# Altium project lora_gateway.PrjPcb
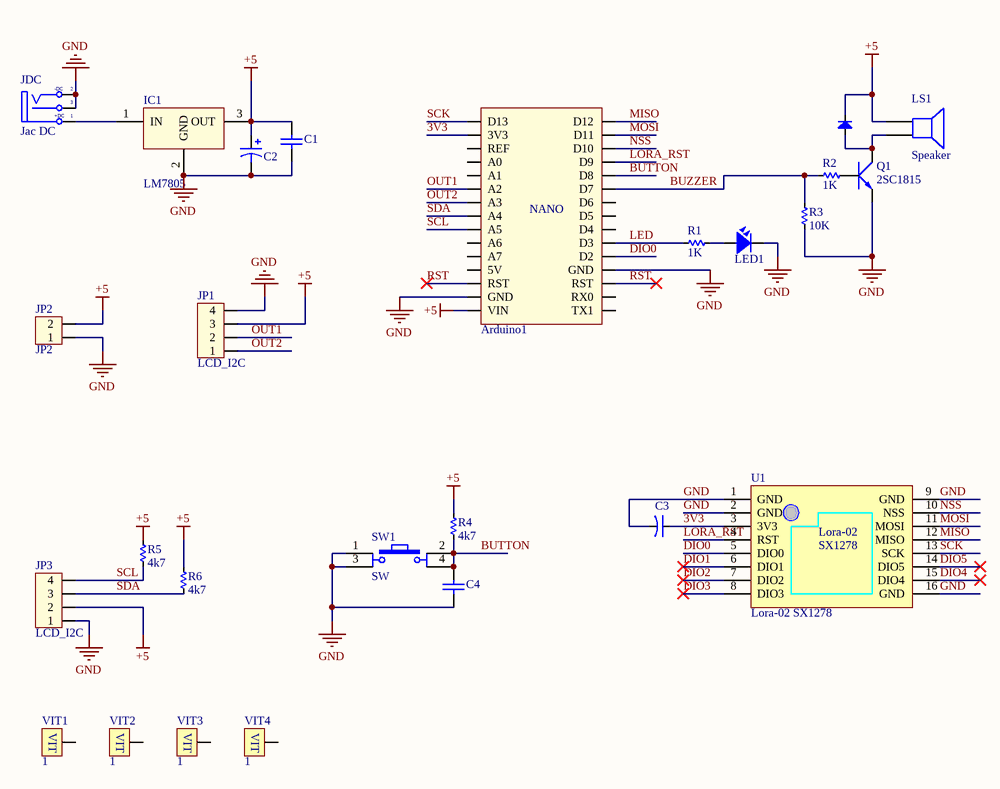
[diagram p0: Sheet1.SchDoc]
1 sheet, 26 parts. Net scope: global (net labels, ports and power ports of the same name join across sheets).
Board file: PCB1.PcbDoc

## Sheet Sheet1.SchDoc
size A; SheetNumber: 1; SheetTotal: 1

### Parts
Arduino1  Arduino Nano  [Arduino Nano]  (value not drawn)
C1  Capacitor Ceramic  [C0805]  (value not drawn)
C2  Cap Pol 8mm  [C10mm]  (value not drawn)
C3  CN-ALU-DIP  [CA-ALU-5W]  (value not drawn)
C4  Capacitor Ceramic  [C0805]  (value not drawn)
DIO1  Diode SMD  [DIO-SMD-106]  (value not drawn)
IC1  LM7805  [QTO-220]
JDC  Jac DC  [DC0]
JP1  LCD_I2C  [CON4]
JP2  JP2  [CON2]
JP3  LCD_I2C  [CON4]
LED1  LED  [LED-3MM-YELLOW]  (value not drawn)
LS1  Speaker  [SPEAKER]
Q1  2SC1815  [TO92-123]
R1  1K  [RES-SMD-1206]
R2  1K  [RES-SMD-1206]
R3  10K  [RES-SMD-1206]
R4  4k7  [RES-SMD-1206]
R5  4k7  [RES-SMD-1206]
R6  4k7  [RES-SMD-1206]
SW1  SW  [SW4]
U1  Lora-02 SX1278  [Lora02-sx1278]
VIT1  1  [VIT]
VIT2  1  [VIT]
VIT3  1  [VIT]
VIT4  1  [VIT]

### Nets
+5: Arduino1.VIN C1.2 C2.1 DIO1.2(K) IC1.3(OUT) JP1.3 JP2.2 JP3.2 LS1.1 R4.1 R5.1 R6.2
GND: Arduino1.GND C1.1 C2.2 C3.2 C4.1 IC1.2(GND) JDC.2(TN) JDC.3(S) JP1.4 JP2.1 JP3.1 LED1.2 Q1.1(E) R3.1 SW1.1 SW1.3 U1.1(GND) U1.2(GND) U1.9(GND) U1.16(GND)
3V3: Arduino1.3V3 C3.1 U1.3(3V3)
BUTTON: Arduino1.D8 C4.2 R4.2 SW1.2 SW1.4
BUZZER: Arduino1.D7 R2.1 R3.2
DIO0: Arduino1.D2 U1.5(DIO0)
DIO1: U1.6(DIO1)
DIO2: U1.7(DIO2)
DIO3: U1.8(DIO3)
DIO4: U1.15(DIO4)
DIO5: U1.14(DIO5)
LED: Arduino1.D3 R1.1
LORA_RST: Arduino1.D9 U1.4(RST)
MISO: Arduino1.D12 U1.12(MISO)
MOSI: Arduino1.D11 U1.11(MOSI)
NSS: Arduino1.D10 U1.10(NSS)
OUT1: Arduino1.A2 JP1.2
OUT2: Arduino1.A3 JP1.1
RST: Arduino1.RST
SCK: Arduino1.D13 U1.13(SCK)
SCL: Arduino1.A5 JP3.4 R5.2
SDA: Arduino1.A4 JP3.3 R6.1
NetDIO1_1: DIO1.1(A) LS1.2 Q1.2(C)
NetIC1_1: IC1.1(IN) JDC.1(T)
NetLED1_1: LED1.1 R1.2
NetQ1_3: Q1.3(B) R2.2

Not connected (* = marked no-connect by the designer): Arduino1 5V A0 A1 A6 A7 D4 D5 D6 REF RX0 TX1; VIT1 VIT1(1); VIT2 VIT1(1); VIT3 VIT1(1); VIT4 VIT1(1)

### Notes on the sheet
- (in symbol Arduino Nano) NANO
- (in symbol DCIN) -DC; +DC
- (in symbol Lora-02 SX1278) Lora-02; SX1278

### Library data of the parts
Arduino1 = Arduino Nano: Value: Cau 1A
C1 C4 = CapSMD: Capacitor; Value: 33p; Published: 8-Jun-2000; LatestRevisionDate: 17-Jul-2002; LatestRevisionNote: Re-released for DXP Platform.; PackageReference: RAD-0.3; Publisher: Altium Limited
C2 = Cap Pol 8mm: Polarized Capacitor (Axial); Published: 8-Jun-2000; LatestRevisionDate: 17-Jul-2002; LatestRevisionNote: Re-released for DXP Platform.; PackageReference: POLAR0.8; Publisher: Altium Limited
C3 = CN-ALU-DIP: Capacitor (Semiconductor SIM Model); Value: 104; LatestRevisionDate: 17-Jul-2002; LatestRevisionNote: Re-released for DXP Platform.; PackageReference: C1206; Publisher: Altium Limited
DIO1 = Diode SMD: Default Diode; Code - JEDEC: DO-214-AB; Value: 1N5007; Published: 8-Jun-2000; Revision: July-2002: Re-released for DXP Platform.; Publisher: Altium Limited
IC1 = LM78xx: On ap +, from + 5 to + 24VDC; Value: LM7805
JDC = DCIN: Jac DC input; Value: Jac DC
JP1 JP3 = Con4: Connector 4; Value: Connector 4
JP2 = Con2: Connector 2; Value: Connector 2
LED1 = LED: LED Single colour Green and Red; Value: LED 3 ly Single Colour
LS1 = Speaker: Loudspeaker; Published: 24-Mar-1999; LatestRevisionDate: 17-Jul-2002; LatestRevisionNote: Re-released for DXP Platform.; PackageReference: PIN2; Publisher: Altium Limited
Q1 = 2SC1815: NPN 600mW, ECB; Value: C1815
R1-R6 = Res-SMD: Resistor; Manufacturer: Generic Components; Class: Passive; Published: 08/06/2000; Publisher: Altium Hobart Technology Centre
SW1 = SW4: Switch button 4 pin; Value: Button chip 4 pin
VIT1-VIT4 = VIT: Oc Vit